# EAGLE design cnc_rev3 (EAGLE 9.5.2)
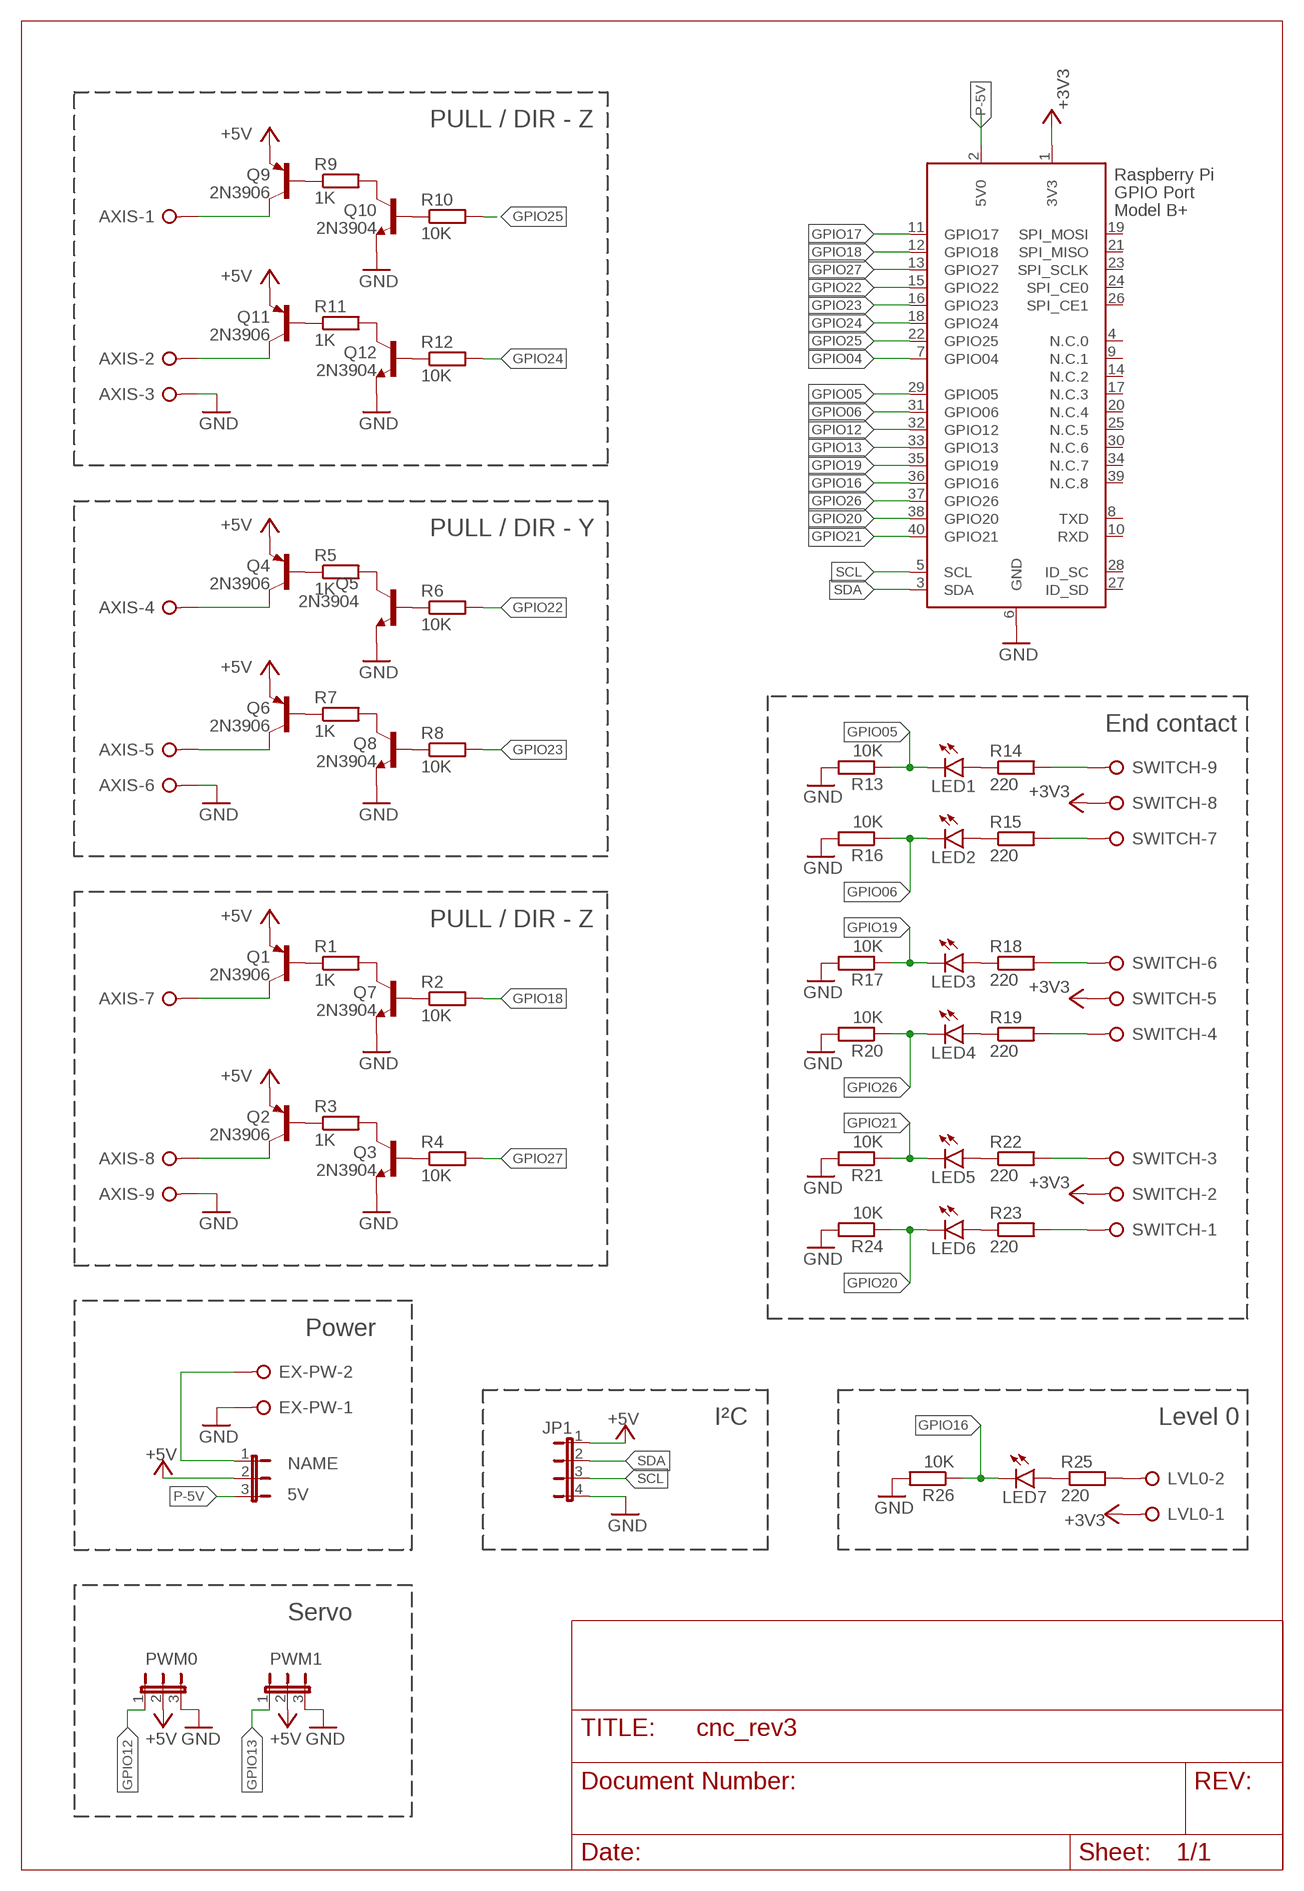
[diagram p0: schematic, sheet 1]

## Parts
AXIS  W237-09P  [W237-9P]
EX-PW  W237-02P  [W237-132]
JP1  JP4E  [JP4]
JP_5V  5V  JP2E  [JP2]
LED1  LED3MM  [LED3MM]
LED2  LED3MM  [LED3MM]
LED3  LED3MM  [LED3MM]
LED4  LED3MM  [LED3MM]
LED5  LED3MM  [LED3MM]
LED6  LED3MM  [LED3MM]
LED7  LED3MM  [LED3MM]
LVL0  W237-02P  [W237-132]
PWM0  JP2E  [JP2]
PWM1  JP2E  [JP2]
Q1  2N3906  [TO92]
Q2  2N3906  [TO92]
Q3  2N3904  [TO92]
Q4  2N3906  [TO92]
Q5  2N3904  [TO92]
Q6  2N3906  [TO92]
Q7  2N3904  [TO92]
Q8  2N3904  [TO92]
Q9  2N3906  [TO92]
Q10  2N3904  [TO92]
Q11  2N3906  [TO92]
Q12  2N3904  [TO92]
R1  1K  R-EU_0414/5V  [0414V]
R2  10K  R-EU_0414/5V  [0414V]
R3  1K  R-EU_0414/5V  [0414V]
R4  10K  R-EU_0414/5V  [0414V]
R5  1K  R-EU_0414/5V  [0414V]
R6  10K  R-EU_0414/5V  [0414V]
R7  1K  R-EU_0414/5V  [0414V]
R8  10K  R-EU_0414/5V  [0414V]
R9  1K  R-EU_0414/5V  [0414V]
R10  10K  R-EU_0414/5V  [0414V]
R11  1K  R-EU_0414/5V  [0414V]
R12  10K  R-EU_0414/5V  [0414V]
R13  10K  R-EU_0414/5V  [0414V]
R14  220  R-EU_0414/5V  [0414V]
R15  220  R-EU_0414/5V  [0414V]
R16  10K  R-EU_0414/5V  [0414V]
R17  10K  R-EU_0414/5V  [0414V]
R18  220  R-EU_0414/5V  [0414V]
R19  220  R-EU_0414/5V  [0414V]
R20  10K  R-EU_0414/5V  [0414V]
R21  10K  R-EU_0414/5V  [0414V]
R22  220  R-EU_0414/5V  [0414V]
R23  220  R-EU_0414/5V  [0414V]
R24  10K  R-EU_0414/5V  [0414V]
R25  220  R-EU_0414/5V  [0414V]
R26  10K  R-EU_0414/5V  [0414V]
RPI_CONNECT  RASPI_GPIO_B+_BOX  [RASPI_GPIO_B+_BOX]
SWITCH  W237-09P  [W237-9P]

## Nets
+3V3: LVL0.1 RPI_CONNECT.1(3V3) SWITCH.2 SWITCH.5 SWITCH.8
+5V: JP1.1 JP_5V.2 PWM0.2 PWM1.2 Q1.3(E) Q2.3(E) Q4.3(E) Q6.3(E) Q9.3(E) Q11.3(E)
DIRU: AXIS.8 Q2.1(C)
DIRX: AXIS.2 Q11.1(C)
DIRY: AXIS.5 Q6.1(C)
GND: AXIS.3 AXIS.6 AXIS.9 EX-PW.1 JP1.4 PWM0.3 PWM1.3 Q3.3(E) Q5.3(E) Q7.3(E) Q8.3(E) Q10.3(E) Q12.3(E) R13.2 R16.2 R17.2 R20.2 R21.2 R24.2 R26.2 RPI_CONNECT.6(GND)
GPIO04: RPI_CONNECT.7(GPIO04)
GPIO05: LED1.K(C) R13.1 RPI_CONNECT.29(GPIO05)
GPIO06: LED2.K(C) R16.1 RPI_CONNECT.31(GPIO06)
GPIO12: PWM0.1 RPI_CONNECT.32(GPIO12)
GPIO13: PWM1.1 RPI_CONNECT.33(GPIO13)
GPIO16: LED7.K(C) R26.1 RPI_CONNECT.36(GPIO16)
GPIO17: RPI_CONNECT.11(GPIO17)
GPIO18: R2.2 RPI_CONNECT.12(GPIO18)
GPIO19: LED3.K(C) R17.1 RPI_CONNECT.35(GPIO19)
GPIO20: LED6.K(C) R24.1 RPI_CONNECT.38(GPIO20)
GPIO21: LED5.K(C) R21.1 RPI_CONNECT.40(GPIO21)
GPIO22: R6.2 RPI_CONNECT.15(GPIO22)
GPIO23: R8.2 RPI_CONNECT.16(GPIO23)
GPIO24: R12.2 RPI_CONNECT.18(GPIO24)
GPIO25: R10.2 RPI_CONNECT.22(GPIO25)
GPIO26: LED4.K(C) R20.1 RPI_CONNECT.37(GPIO26)
GPIO27: R4.2 RPI_CONNECT.13(GPIO27)
N$1: Q1.2(B) R1.1
N$2: Q7.1(C) R1.2
N$3: Q7.2(B) R2.1
N$4: LED7.A R25.1
N$5: LVL0.2 R25.2
N$6: Q4.2(B) R5.1
N$7: LED1.A R14.1
N$8: Q2.2(B) R3.1
N$9: Q3.2(B) R4.1
N$10: Q3.1(C) R3.2
N$12: Q5.2(B) R6.1
N$13: Q5.1(C) R5.2
N$17: Q6.2(B) R7.1
N$18: Q8.2(B) R8.1
N$19 [vcc]: Q8.1(C) R7.2
N$22: Q9.2(B) R9.1
N$23: Q10.2(B) R10.1
N$24: Q10.1(C) R9.2
N$26: Q11.2(B) R11.1
N$27: Q12.2(B) R12.1
N$28: Q12.1(C) R11.2
N$35: R14.2 SWITCH.9
N$36: LED2.A R15.1
N$37: R15.2 SWITCH.7
N$39: LED3.A R18.1
N$41: R18.2 SWITCH.6
N$42: LED4.A R19.1
N$43: R19.2 SWITCH.4
N$45: LED5.A R22.1
N$47: R22.2 SWITCH.3
N$48: LED6.A R23.1
N$49: R23.2 SWITCH.1
P-5V: JP_5V.3 RPI_CONNECT.2(5V0)
P-EXT: EX-PW.2 JP_5V.1
PULU: AXIS.7 Q1.1(C)
PULY: AXIS.4 Q4.1(C)
PULZ: AXIS.1 Q9.1(C)
SCL: JP1.3 RPI_CONNECT.5(SCL)
SDA: JP1.2 RPI_CONNECT.3(SDA)
Unconnected: RPI_CONNECT.4(N.C.0) RPI_CONNECT.8(TXD) RPI_CONNECT.9(N.C.1) RPI_CONNECT.10(RXD) RPI_CONNECT.14(N.C.2) RPI_CONNECT.17(N.C.3) RPI_CONNECT.19(SPI_MOSI) RPI_CONNECT.20(N.C.4) RPI_CONNECT.21(SPI_MISO) RPI_CONNECT.23(SPI_SCLK) RPI_CONNECT.24(SPI_CE0) RPI_CONNECT.25(N.C.5) RPI_CONNECT.26(SPI_CE1) RPI_CONNECT.27(ID_SD) RPI_CONNECT.28(ID_SC) RPI_CONNECT.30(N.C.6) RPI_CONNECT.34(N.C.7) RPI_CONNECT.39(N.C.8)

## Notes on the sheet
- PULL / DIR - Z
- PULL / DIR - Y
- End contact
- PULL / DIR - Z
- Power
- I²C | Level 0
- Servo

## Library data of the parts
AXIS SWITCH = con-wago-508:W237-09P: WAGO SREW CLAMP; OC_FARNELL: unknown; OC_NEWARK: unknown
EX-PW LVL0 = con-wago-508:W237-02P: WAGO SREW CLAMP; OC_FARNELL: unknown; OC_NEWARK: unknown
JP1 = jumper:JP4E: JUMPER
JP_5V PWM0 PWM1 = jumper:JP2E: JUMPER
LED1-LED7 = led:LED: LED OSRAM: - CHIPLED LG R971, LG N971, LY N971, LG Q971, LY Q971, LO R971, LY R971 LH N974, LH R974 LS Q976, LO Q976, LY Q976 LO Q996 - Hyper CHIPLED LW Q18S LB Q993, LB Q99A, LB R99A - SideLED LS A670, LO A670, LY A670, LG A670, LP A670 LB A673, LV A673, LT A673, LW A673 LH A674 LY A675 LS A676, LA A676, LO A676, LY A676, LW A676 LS A679, LY A679, LG A679 - Hyper Micro SIDELED® LS Y876, LA Y876, LO Y876, LY Y876 LT Y87S - SmartLED LW L88C, LW L88S LB L89C, LB L89S, LG L890 LS L89K, LO L89K, LY L89K LS L896, LA L896, LO L896, LY L896 - TOPLED LS T670, LO T670, LY T670, LG T670, LP T670 LSG T670, LSP T670, LSY T670, LOP T670, LYG T670 LG T671, LOG T671, LSG T671 LB T673, LV T673, LT T673, LW T673 LH T674 LS T676, LA T676, LO T676, LY T676, LB T676, LH T676, LSB T676, LW T676 LB T67C, LV T67C, LT T67C, LS T67K, LO T67K, LY T67K, LW E67C LS E67B, LA E67B, LO E67B, LY E67B, LB E67C, LV E67C, LT E67C LW T67C LS T679, LY T679, LG T679 LS T770, LO T770, LY T770, LG T770, LP T770 LB T773, LV T773, LT T773, LW T773 LH T774 LS E675, LA E675, LY E675, LS T675 LS T776, LA T776, LO T776, LY T776, LB T776 LHGB T686 LT T68C, LB T68C - Hyper Mini TOPLED® LB M676 - Mini TOPLED Santana® LG M470 LS M47K, LO M47K, LY M47K Source: http://www.osram.convergy.de LUXEON: - LUMILED® LXK2-PW12-R00, LXK2-PW12-S00, LXK2-PW14-U00, LXK2-PW14-V00 LXK2-PM12-R00, LXK2-PM12-S00, LXK2-PM14-U00 LXK2-PE12-Q00, LXK2-PE12-R00, LXK2-PE12-S00, LXK2-PE14-T00, LXK2-PE14-U00 LXK2-PB12-K00, LXK2-PB12-L00, LXK2-PB12-M00, LXK2-PB14-N00, LXK2-PB14-P00, LXK2-PB14-Q00 LXK2-PR12-L00, LXK2-PR12-M00, LXK2-PR14-Q00, LXK2-PR14-R00 LXK2-PD12-Q00, LXK2-PD12-R00, LXK2-PD12-S00 LXK2-PH12-R00, LXK2-PH12-S00 LXK2-PL12-P00, LXK2-PL12-Q00, LXK2-PL12-R00 Source: www.luxeon.com KINGBRIGHT: KA-3528ASYC Source: www.kingbright.com
Q1 Q2 Q4 Q6 Q9 Q11 = transistor-pnp:2N3906: PNP Transistor
Q3 Q5 Q7 Q8 Q10 Q12 = transistor:2N3904: NPN TRANSISTOR
R1-R26 = rcl:R-EU_: RESISTOR, European symbol; SPICEPREFIX: R
RPI_CONNECT = raspberrypi_bastelstube_v13:RASPI_GPIO_B+: Only the 2x20 header connector, nothing else

## Board
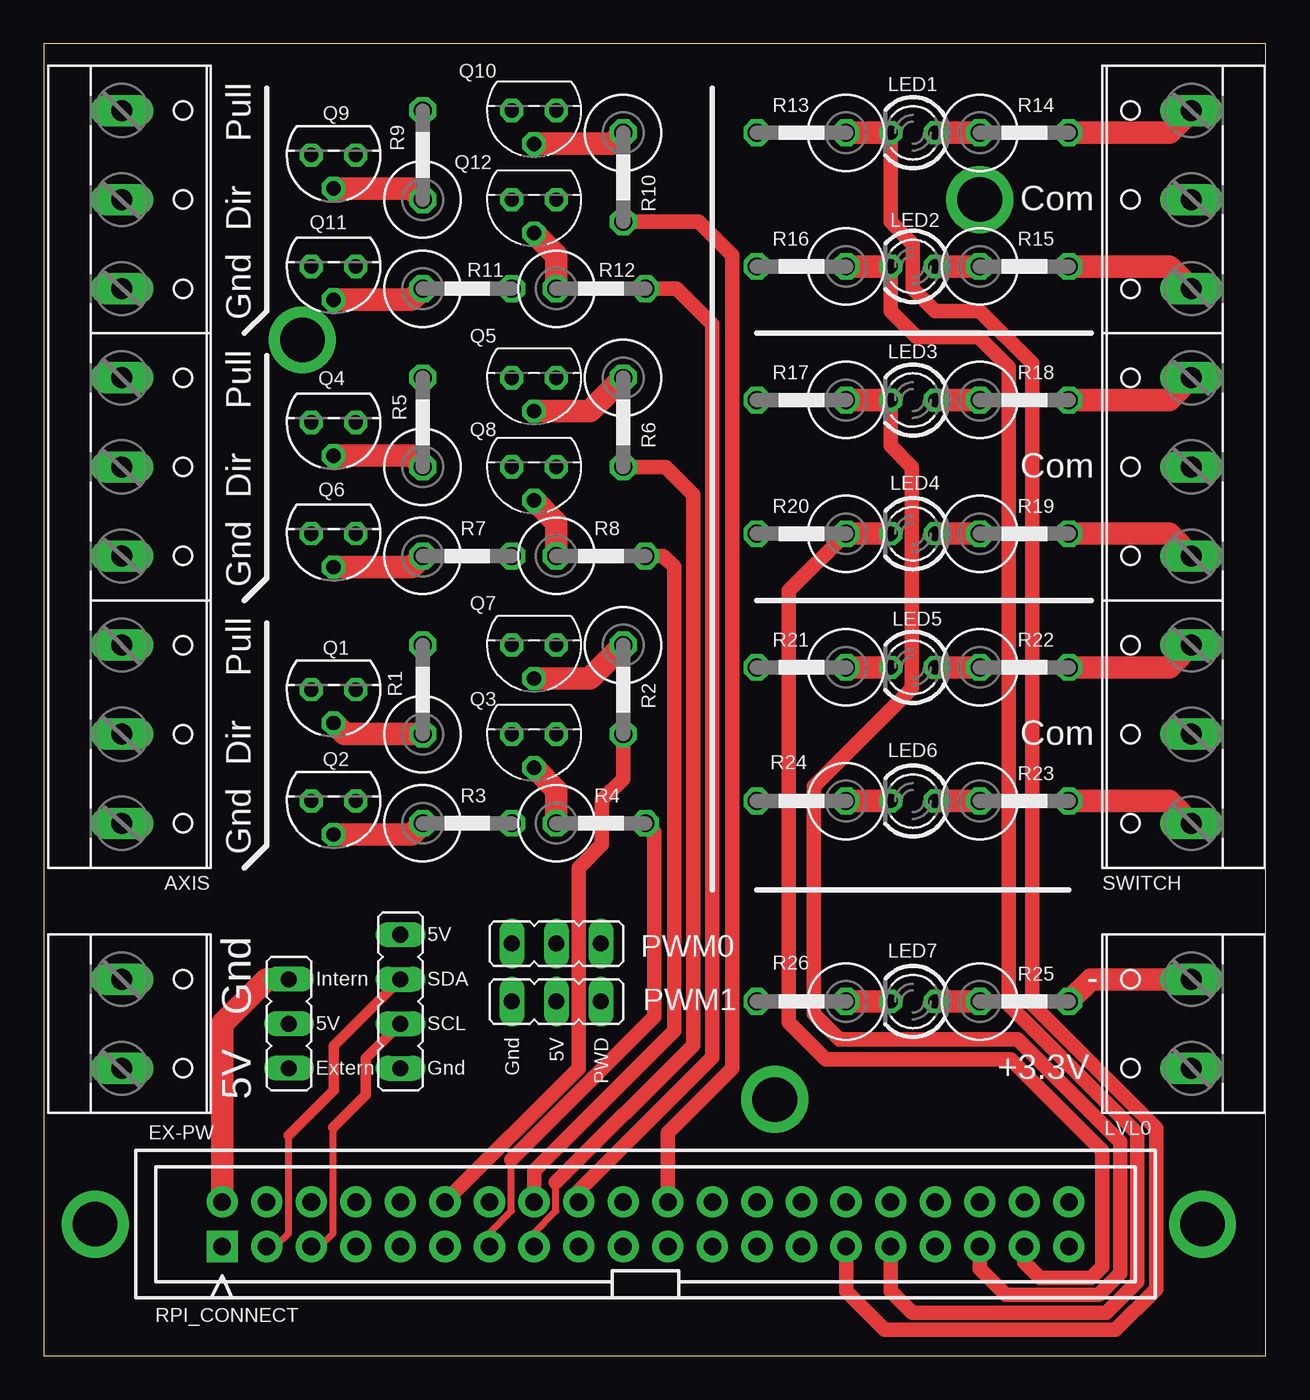
[diagram p1: board, top side]
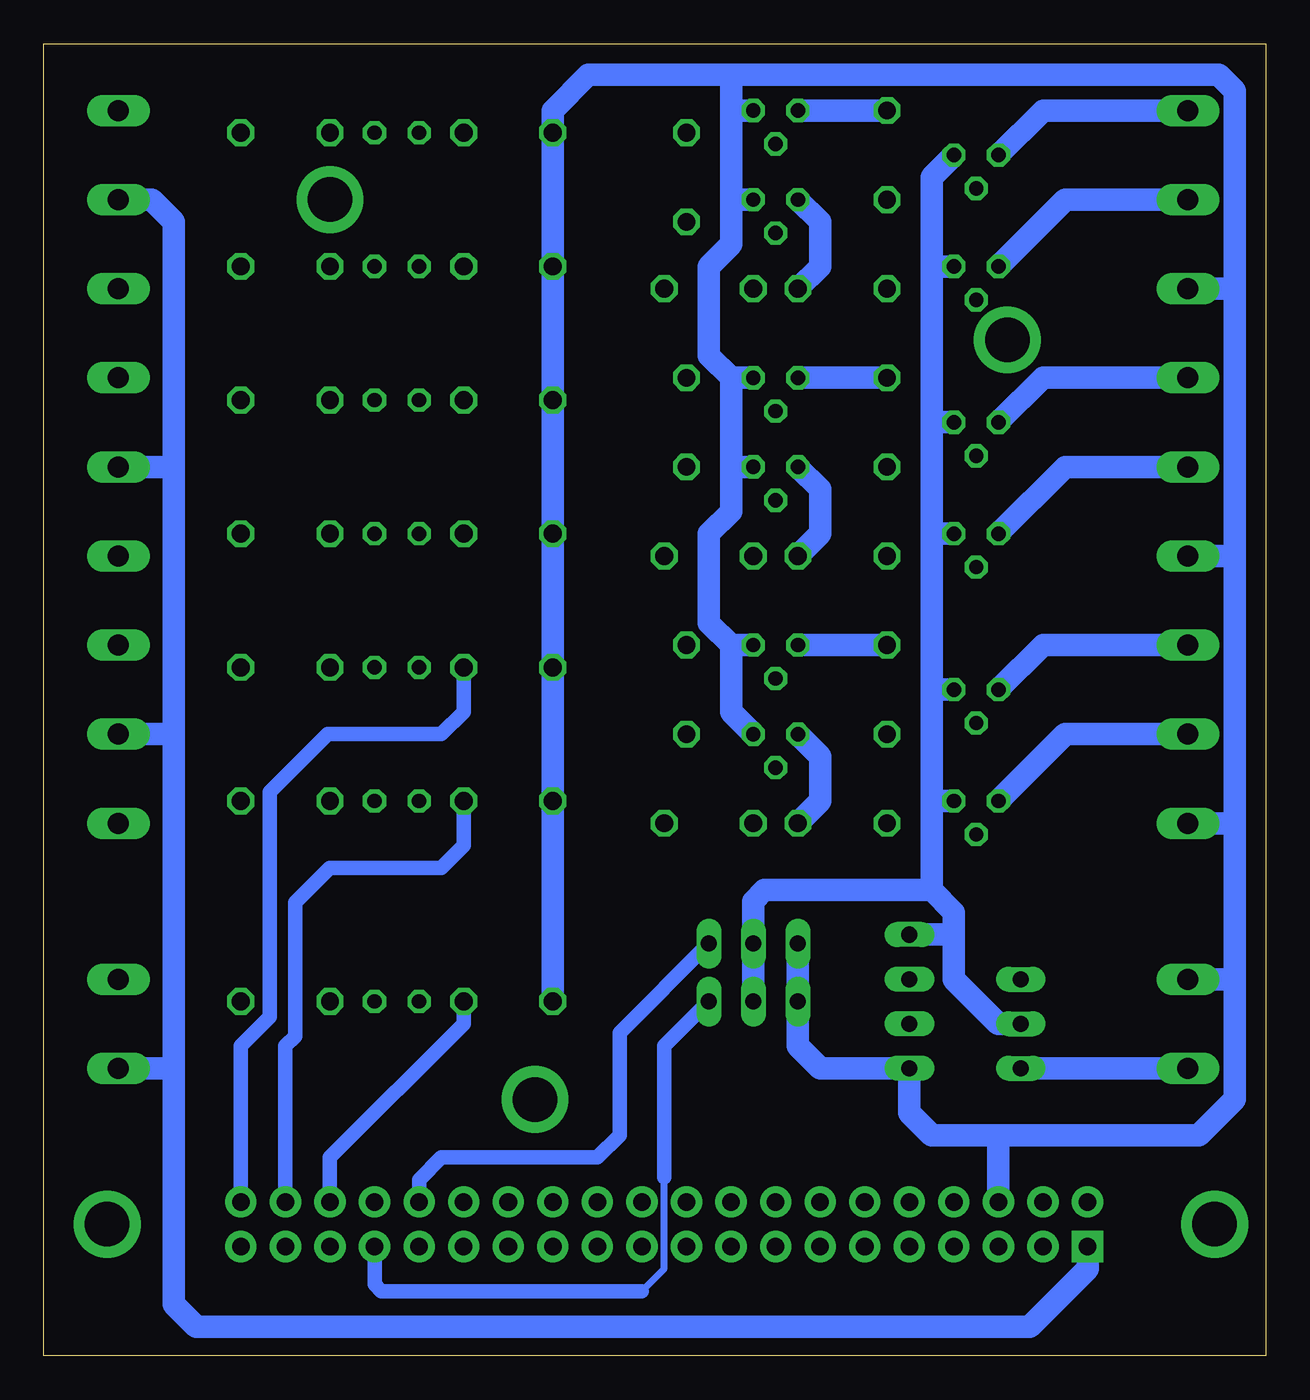
[diagram p2: board, bottom side, seen from below]

Size 69.65 x 74.79 mm. Coordinates in mm from the lower left corner, seen from the top.
Outline: 0,0 69.65,0 69.65,74.79 0,74.79 0,0
Copper layers (1*16): Top 0.035mm / dielectric 1.5mm / Bottom 0.035mm
Design rules "default": minimum track width 6mil, minimum drill 0.35mm, track to track 6mil, track to pad 6mil, pad to pad 6mil, via to via 6mil, smd to smd 6mil, copper to edge 40mil, drill to drill 6mil, minimum pad ring 10mil, minimum via ring 8mil, stop-mask expansion 4mil, vias tented up to drill 0mil, thermal gap 10mil

### Footprints (pad centres in the part's own frame; a part is rotated, then mirrored left to right if it is on the bottom)
W237-9P = drill 1.194 long: 1 -20.32,-0.635; 2 -15.24,-0.635; 3 -10.16,-0.635; 4 -5.08,-0.635; 5 0,-0.635; 6 5.08,-0.635; 7 10.16,-0.635; 8 15.24,-0.635; 9 20.32,-0.635
W237-132 = drill 1.194 long: 1 -2.54,-0.635; 2 2.54,-0.635
JP4 = drill 0.914 long: 1 -3.81,0; 2 -1.27,0; 3 1.27,0; 4 3.81,0
JP2 = drill 0.914 long: 1 -2.54,0; 2 0,0; 3 2.54,0
LED3MM = drill 0.813 octagon: A -1.27,0; K 1.27,0
TO92 = drill 0.813 octagon: 1 1.27,0; 2 0,1.905; 3 -1.27,0
0414V = drill 1.016 octagon: 1 -2.54,0; 2 2.54,0
RASPI_GPIO_B+_BOX = drill 1 pad 1.778 square: 1 -24.13,-1.27 | drill 1 pad 1.778: 2 -24.13,1.27; 3 -21.59,-1.27; 4 -21.59,1.27; 5 -19.05,-1.27; 6 -19.05,1.27; 7 -16.51,-1.27; 8 -16.51,1.27; 9 -13.97,-1.27; 10 -13.97,1.27; 11 -11.43,-1.27; 12 -11.43,1.27; 13 -8.89,-1.27; 14 -8.89,1.27; 15 -6.35,-1.27; 16 -6.35,1.27; 17 -3.81,-1.27; 18 -3.81,1.27; 19 -1.27,-1.27; 20 -1.27,1.27; 21 1.27,-1.27; 22 1.27,1.27; 23 3.81,-1.27; 24 3.81,1.27; 25 6.35,-1.27; 26 6.35,1.27; 27 8.89,-1.27; 28 8.89,1.27; 29 11.43,-1.27; 30 11.43,1.27; 31 13.97,-1.27; 32 13.97,1.27; 33 16.51,-1.27; 34 16.51,1.27; 35 19.05,-1.27; 36 19.05,1.27; 37 21.59,-1.27; 38 21.59,1.27; 39 24.13,-1.27; 40 24.13,1.27

### Placement (x,y rotation side)
AXIS  5.08,50.67 270 top
EX-PW  5.08,18.92 270 top
JP1  20.32,20.19 270 top
JP_5V  13.97,18.92 90 top
LED1  49.53,69.72 180 top
LED2  49.53,62.1 180 top
LED3  49.53,54.48 180 top
LED4  49.53,46.86 180 top
LED5  49.53,39.24 180 top
LED6  49.53,31.62 180 top
LED7  49.53,20.19 180 top
LVL0  64.77,18.92 90 top
PWM0  29.21,23.5 180 top
PWM1  29.21,20.19 180 top
Q1  16.51,37.97 180 top
Q2  16.51,31.62 180 top
Q3  27.94,35.43 180 top
Q4  16.51,53.21 180 top
Q5  27.94,55.75 180 top
Q6  16.51,46.86 180 top
Q7  27.94,40.51 180 top
Q8  27.94,50.67 180 top
Q9  16.51,68.45 180 top
Q10  27.94,70.99 180 top
Q11  16.51,62.1 180 top
Q12  27.94,65.91 180 top
R1  21.59,37.97 90 top
R2  33.02,37.97 270 top
R3  24.13,30.35 0 top
R4  31.75,30.35 0 top
R5  21.59,53.21 90 top
R6  33.02,53.21 270 top
R7  24.13,45.59 0 top
R8  31.75,45.59 0 top
R9  21.59,68.45 90 top
R10  33.02,67.18 270 top
R11  24.13,60.83 0 top
R12  31.75,60.83 0 top
R13  43.18,69.72 180 top
R14  55.88,69.72 0 top
R15  55.88,62.1 0 top
R16  43.18,62.1 180 top
R17  43.18,54.48 180 top
R18  55.88,54.48 0 top
R19  55.88,46.86 0 top
R20  43.18,46.86 180 top
R21  43.18,39.24 180 top
R22  55.88,39.24 0 top
R23  55.88,31.62 0 top
R24  43.18,31.62 180 top
R25  55.88,20.19 0 top
R26  43.18,20.19 180 top
RPI_CONNECT  34.29,7.49 0 top
SWITCH  64.77,50.67 90 top

### Tracks (layer width: path | path; a pad name or v marks a point on that pad's centre or on a via)
+3V3
  Bottom 1.27: 62.23,35.43 62.23,50.67 | 62.23,50.67 62.23,64.64 63.5,65.91 SWITCH.8 | SWITCH.5 62.23,50.67 | SWITCH.2 62.23,35.43 | LVL0.1 62.23,16.38 | 62.23,16.38 62.23,35.43 | RPI_CONNECT.1 10.16,4.95 13.46,1.65 60.96,1.65 62.23,2.92 62.23,16.38
+5V
  Bottom 1.27: PWM1.2 PWM0.2 29.21,25.91 28.57,26.54 19.05,26.54 | Q2.3 19.05,31.62 | 19.05,37.97 19.05,31.62 | 19.05,37.97 19.05,46.86 | 19.05,46.86 19.05,53.21 | 19.05,53.21 19.05,62.1 | 19.05,62.1 19.05,67.18 Q9.3 | Q11.3 19.05,62.1 | Q4.3 19.05,53.21 | Q6.3 19.05,46.86 | Q1.3 19.05,37.97 | 19.05,31.62 19.05,26.54 | JP_5V.2 15.24,18.92 17.78,21.46 17.78,24 | 19.05,26.54 17.78,25.27 17.78,24 | JP1.1 17.78,24
DIRU
  Bottom 1.27: Q2.1 11.43,35.43 AXIS.8
DIRX
  Bottom 1.27: Q11.1 11.43,65.91 AXIS.2
DIRY
  Bottom 1.27: Q6.1 11.43,50.67 AXIS.5
GND
  Bottom 1.27: 1.78,30.35 1.78,21.59 1.91,21.46 EX-PW.1 1.78,21.46 1.78,14.61 3.81,12.57 15.24,12.57 | AXIS.9 1.78,30.35 | 1.78,30.35 1.78,45.59 | 1.78,45.59 1.78,60.83 | AXIS.3 1.78,60.83 | 1.78,45.59 AXIS.6 | PWM0.3 PWM1.3 26.67,17.65 25.4,16.38 JP1.4 20.32,13.84 19.05,12.57 15.24,12.57 | 30.48,73.03 38.61,73.03 40.64,70.99 R13.2 R16.2 R17.2 R20.2 R21.2 R24.2 R26.2 | 30.48,70.99 30.48,65.91 | 30.48,65.91 Q12.3 | 30.48,65.91 30.48,63.37 31.75,62.1 31.75,57.02 30.48,55.75 | 30.48,55.75 Q5.3 | 30.48,50.67 30.48,48.13 31.75,46.86 31.75,41.78 30.48,40.51 | Q7.3 30.48,40.51 | 30.48,40.51 30.48,36.7 Q3.3 | 30.48,73.03 2.69,73.03 1.78,72.11 1.78,60.83 | Q10.3 30.48,70.99 | 30.48,70.99 30.48,73.03 | 30.48,50.67 30.48,55.75 | Q8.3 30.48,50.67 | RPI_CONNECT.6 15.24,12.57
GPIO05
  Top 0.813: RPI_CONNECT.29 45.72,3.68 47.93,1.47 61.07,1.47 63.39,3.79 63.39,12.97 56.33,20.03 56.33,56.58 53.34,59.56 50.8,59.56 49.53,60.83 49.53,63.37 48.26,64.64 LED1.K
  Top 1.27: LED1.K R13.1
GPIO06
  Top 0.813: RPI_CONNECT.31 48.26,3.68 49.51,2.44 60.54,2.44 62.33,4.22 62.33,12.67 54.99,20 54.99,56.35 53.27,58.07 49.75,58.07 48.26,59.56 LED2.K
  Top 1.27: LED2.K R16.1
GPIO12
  Bottom 0.813: RPI_CONNECT.32 48.26,10.03 46.99,11.3 38.1,11.3 36.83,12.57 36.83,18.41 PWM0.1
GPIO13
  Bottom 0.406: 34.29,10.16 34.29,4.95 35.56,3.68
  Bottom 0.813: 35.56,3.68 50.42,3.68 50.8,4.06 RPI_CONNECT.33 | PWM1.1 34.29,17.65 34.29,10.16
GPIO16
  Top 1.27: R26.1 LED7.K
  Bottom 0.813: RPI_CONNECT.36 53.34,11.3 45.72,18.92 R26.1
GPIO18
  Top 0.813: RPI_CONNECT.12 30.48,16.38 30.48,27.81 31.8,29.13 31.8,31.67 33.02,32.89 R2.2
GPIO19
  Top 0.813: RPI_CONNECT.35 53.34,4.95 54.81,3.48 60.12,3.48 61.34,4.7 61.34,12.19 55.5,18.03 45.34,18.03 43.89,19.48 43.89,32.46 49.48,38.05 49.48,50.67 48.26,51.89 LED3.K
  Top 1.27: LED3.K R17.1
GPIO20
  Top 1.27: LED6.K R24.1
  Bottom 0.813: R24.1 45.72,29.08 46.99,27.81 53.34,27.81 55.32,25.83 55.32,18.21 55.88,17.65 RPI_CONNECT.38
GPIO21
  Top 1.27: LED5.K R21.1
  Bottom 0.813: RPI_CONNECT.40 58.42,17.65 56.77,19.3 56.77,32.13 53.47,35.43 46.99,35.43 45.72,36.7 R21.1
GPIO22
  Top 0.406: RPI_CONNECT.15 27.94,7 29.18,8.25 29.18,9.88
  Top 0.813: R6.2 35.43,50.67 37.01,49.1 37.01,17.7 29.18,9.88
GPIO23
  Top 0.813: RPI_CONNECT.16 27.94,10.54 35.92,18.52 35.92,44.98 35.31,45.59 R8.2
GPIO24
  Top 0.813: RPI_CONNECT.18 30.48,9.4 38.1,17.02 38.1,58.8 36.07,60.83 R12.2
GPIO25
  Top 0.813: RPI_CONNECT.22 35.56,12.7 39.24,16.38 39.24,62.74 37.34,64.64 R10.2
GPIO26
  Top 0.813: RPI_CONNECT.37 55.88,5.33 56.77,4.45 59.69,4.45 60.33,5.08 60.33,11.68 55.12,16.89 44.58,16.89 42.47,19 42.47,43.61 R20.1
  Top 1.27: LED4.K R20.1
GPIO27
  Top 0.406: RPI_CONNECT.13 25.4,7 26.64,8.25 26.64,11.15
  Top 0.813: R4.2 34.8,29.84 34.8,19.3 26.64,11.15
N$1
  Top 1.27: R1.1 17.14,35.43 Q1.2
N$2
  Bottom 1.27: Q7.1 R1.2
N$3
  Top 1.27: Q7.2 31.11,38.61 R2.1
N$4
  Top 1.27: LED7.A R25.1
N$5
  Top 1.27: R25.2 59.69,21.46 LVL0.2
N$6
  Top 1.27: R5.1 20.95,51.31 Q4.2
N$7
  Top 1.27: R14.1 LED1.A
N$8
  Top 1.27: Q2.2 20.95,29.72 R3.1
N$9
  Top 1.27: R4.1 29.21,32.26 Q3.2
N$10
  Bottom 1.27: Q3.1 25.4,34.16 25.4,31.62 R3.2
N$11  (via drill 2.54 pad 3.81)
  other vias: 53.34,65.91
N$12
  Top 1.27: Q5.2 31.11,53.85 R6.1
N$13
  Bottom 1.27: Q5.1 R5.2
N$14  (via drill 2.54 pad 3.81)
  other vias: 2.92,7.49
N$15  (via drill 2.54 pad 3.81)
  other vias: 66.04,7.49
N$16  (via drill 2.54 pad 3.81)
  other vias: 41.66,14.61
N$17
  Top 1.27: R7.1 20.95,44.96 Q6.2
N$18
  Top 1.27: R8.1 29.21,47.5 Q8.2
N$19
  Bottom 1.27: Q8.1 25.4,49.4 25.4,46.86 R7.2
N$20  (via drill 2.54 pad 3.81)
  other vias: 14.73,57.91
N$22
  Top 1.27: R9.1 20.95,66.55 Q9.2
N$23
  Top 1.27: Q10.2 32.38,69.09 R10.1
N$24
  Bottom 1.27: Q10.1 R9.2
N$26
  Top 1.27: R11.1 20.95,60.2 Q11.2
N$27
  Top 1.27: R12.1 29.21,62.74 Q12.2
N$28
  Bottom 1.27: Q12.1 25.4,64.64 25.4,62.1 R11.2
N$35
  Top 1.27: SWITCH.9 64.14,69.72 R14.2
N$36
  Top 1.27: R15.1 LED2.A
N$37
  Top 1.27: R15.2 64.14,62.1 SWITCH.7
N$39
  Top 1.27: R18.1 LED3.A
N$41
  Top 1.27: R18.2 64.14,54.48 SWITCH.6
N$42
  Top 1.27: R19.1 LED4.A
N$43
  Top 1.27: R19.2 64.14,46.86 SWITCH.4
N$45
  Top 1.27: R22.1 LED5.A
N$47
  Top 1.27: R22.2 64.14,39.24 SWITCH.3
N$48
  Top 1.27: R23.1 LED6.A
N$49
  Top 1.27: R23.2 64.14,31.62 SWITCH.1
P-5V
  Top 1.27: JP_5V.3 12.7,21.46 10.16,18.92 RPI_CONNECT.2
P-EXT
  Bottom 1.27: EX-PW.2 JP_5V.1
PULU
  Bottom 1.27: Q1.1 12.7,40.51 AXIS.7
PULY
  Bottom 1.27: Q4.1 12.7,55.75 AXIS.4
PULZ
  Bottom 1.27: Q9.1 12.7,70.99 AXIS.1
SCL
  Top 0.406: RPI_CONNECT.5 15.73,6.22 16.48,6.98 16.48,13.03
  Top 0.61: JP1.3 18.34,16.94 18.34,14.88 16.48,13.03
SDA
  Top 0.406: RPI_CONNECT.3 13.19,6.22 13.95,6.98 13.95,12.55
  Top 0.61: JP1.2 16.51,17.65 16.51,15.11 13.95,12.55

### Text on the board
tNames: Pull | Com | Dir | Gnd | Pull | Com | Dir | Gnd | Pull | Com | Dir | Gnd | 5V | Intern | SDA | - | Gnd | 5V | SCL | Gnd | 5V | PWD | Extern | Gnd | +3.3V | 5V